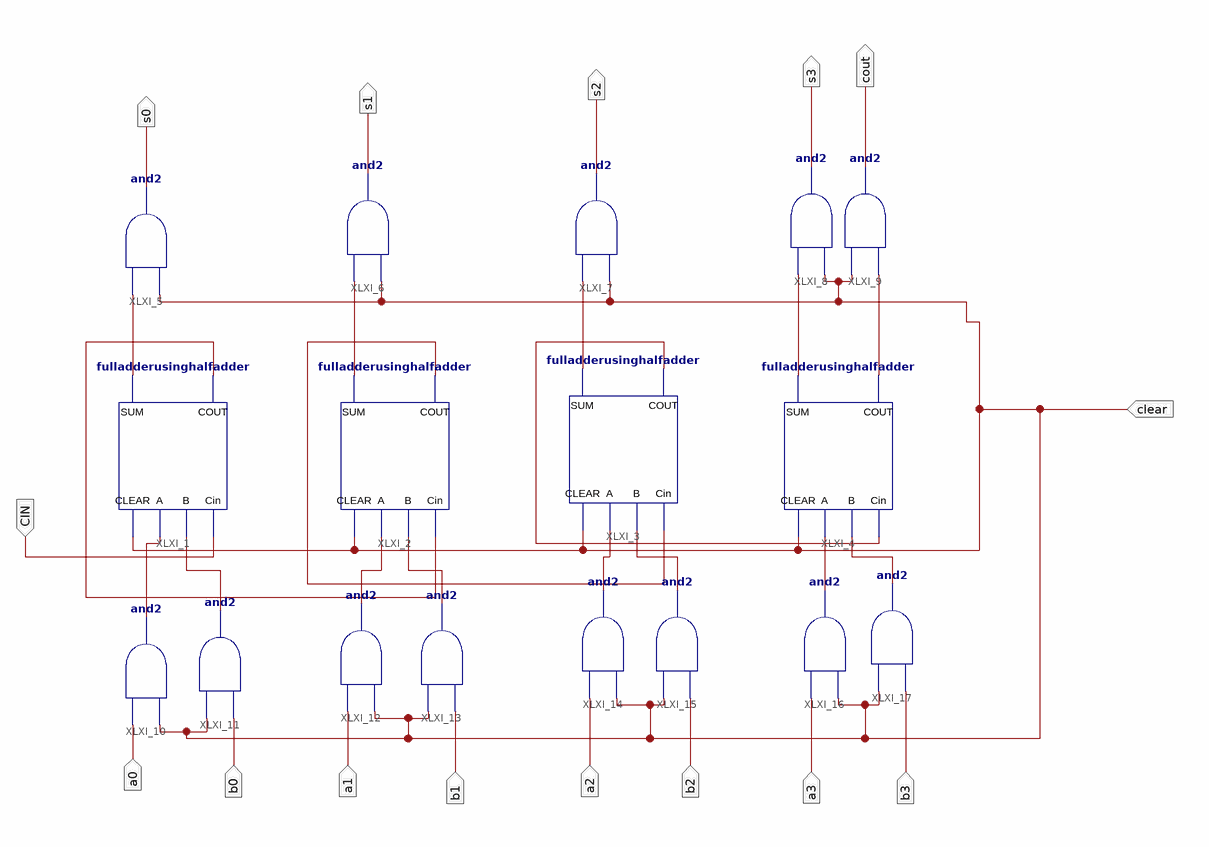
[diagram p0: schematic sheet 1]
// Xilinx ISE schematic fourbitadder.sch (artix7) as structural Verilog: 17 symbols, 15 ports
module fourbitadder (
  input  CIN,
  input  clear,
  input  a0,
  input  b0,
  input  a1,
  input  b1,
  input  a2,
  input  b2,
  input  a3,
  input  b3,
  output s0,
  output s1,
  output s2,
  output s3,
  output cout
);

  wire XLXN_1, XLXN_2, XLXN_4, XLXN_6, XLXN_7, XLXN_21, XLXN_22, XLXN_23, XLXN_25, XLXN_26, XLXN_27, XLXN_34,
       XLXN_38, XLXN_41, XLXN_42, XLXN_43;

  fulladderusinghalfadder XLXI_1 (.CLEAR(clear), .A(XLXN_34), .B(XLXN_21), .Cin(CIN), .SUM(XLXN_1), .COUT(XLXN_41));
  fulladderusinghalfadder XLXI_2 (.CLEAR(clear), .A(XLXN_22), .B(XLXN_23), .Cin(XLXN_41), .SUM(XLXN_2), .COUT(XLXN_42));
  fulladderusinghalfadder XLXI_3 (.CLEAR(clear), .A(XLXN_25), .B(XLXN_26), .Cin(XLXN_42), .SUM(XLXN_4), .COUT(XLXN_43));
  fulladderusinghalfadder XLXI_4 (.CLEAR(clear), .A(XLXN_27), .B(XLXN_38), .Cin(XLXN_43), .SUM(XLXN_6), .COUT(XLXN_7));
  and XLXI_5 (s0, clear, XLXN_1);
  and XLXI_6 (s1, clear, XLXN_2);
  and XLXI_7 (s2, clear, XLXN_4);
  and XLXI_8 (s3, clear, XLXN_6);
  and XLXI_9 (cout, XLXN_7, clear);
  and XLXI_10 (XLXN_34, clear, a0);
  and XLXI_11 (XLXN_21, b0, clear);
  and XLXI_12 (XLXN_22, clear, a1);
  and XLXI_13 (XLXN_23, b1, clear);
  and XLXI_14 (XLXN_25, clear, a2);
  and XLXI_15 (XLXN_26, b2, clear);
  and XLXI_16 (XLXN_27, clear, a3);
  and XLXI_17 (XLXN_38, b3, clear);
endmodule
